# Altium schematic sheet TK525_Kraftforsyning.SchDoc: TK525 Kraftforsyning
size A3; Author: Øystein Smith; Organization: Omega Verksted; DocumentNumber: 16; Revision: 0; SheetNumber: 16; SheetTotal: 20
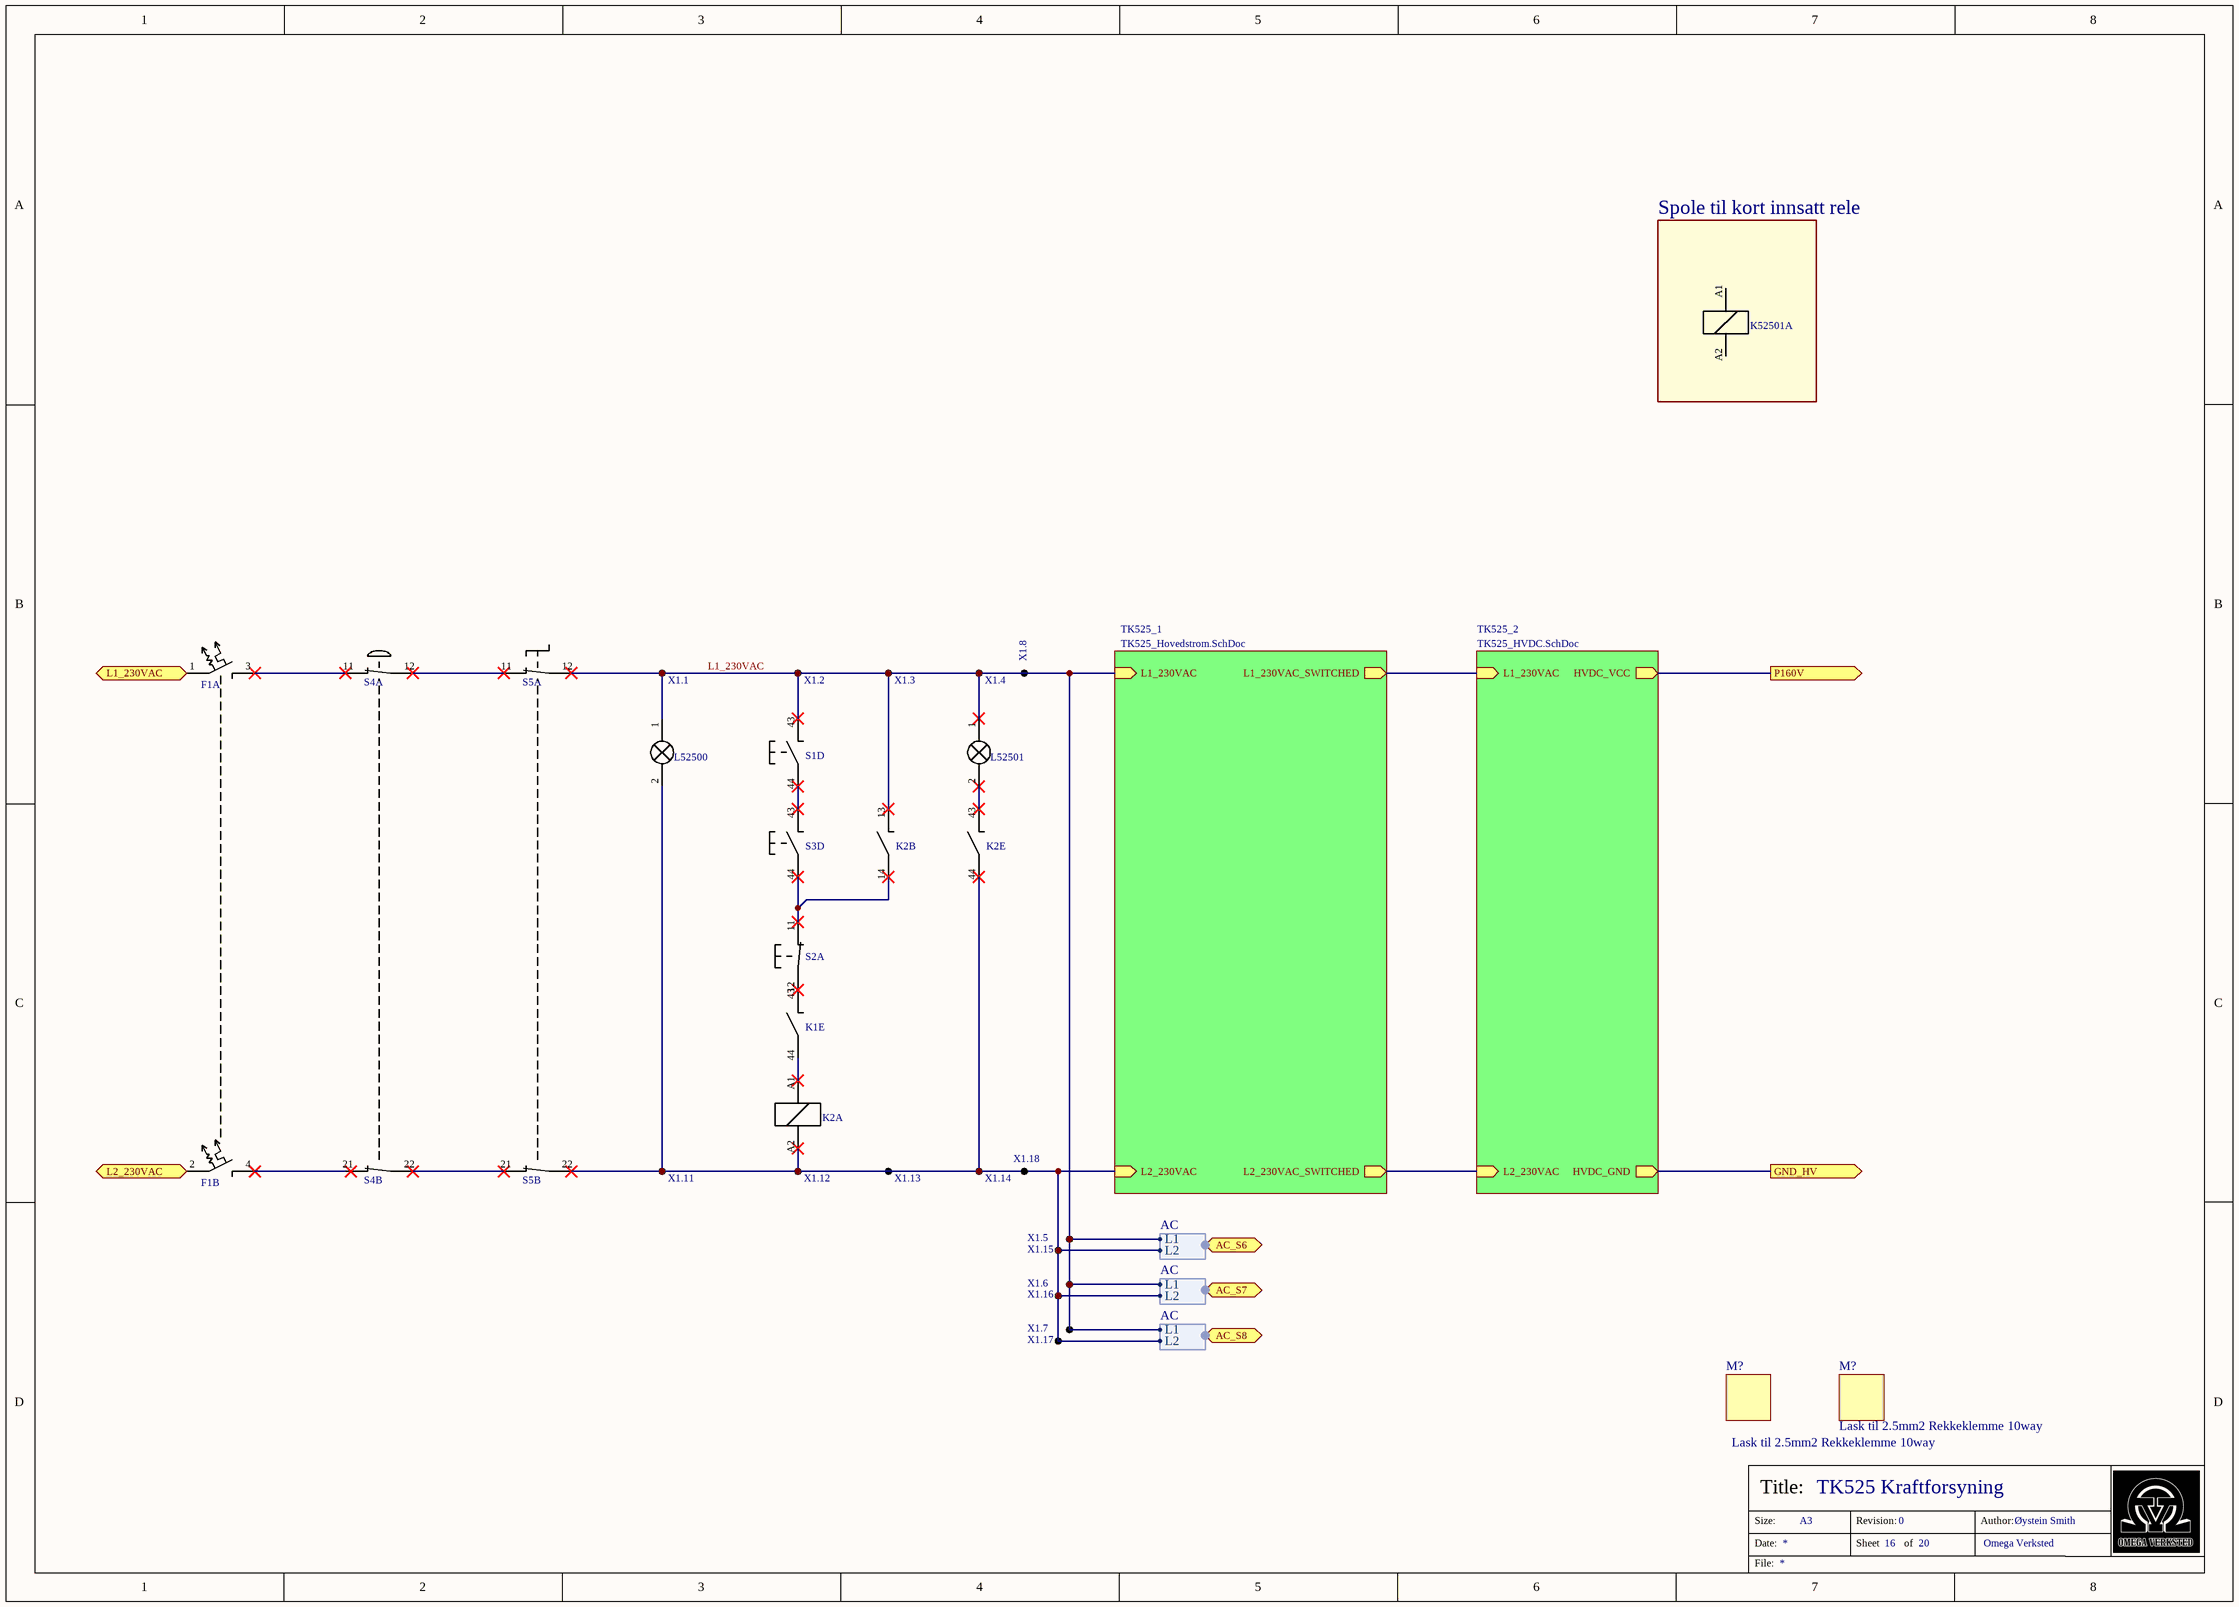
[diagram p0: TK525_Kraftforsyning.SchDoc]

## Parts
(Parts that share a designator on the sheet are numbered #1, #2 ... from top to bottom, then left to right.)
F1  Automatsikring  (value not drawn)  (parts A,B of 2)
K1  DIN-Rele 5V  (value not drawn)  (part E of 6)
K2  Kontaktor  (value not drawn)  (parts A,B,E of 6)
K52501  DIN-Rele 5V  (value not drawn)  (part A of 6)
L52500  Lampe  (value not drawn)
L52501  Lampe  (value not drawn)
M?#1  Lask til 2.5mm2 Rekkeklemme 10way
M?#2  Lask til 2.5mm2 Rekkeklemme 10way
S1  Automasjonsbryter  (value not drawn)  (parts D,G of 10)
S2  Automasjonsbryter  (value not drawn)  (parts A,G of 10)
S3  Automasjonsbryter  (value not drawn)  (parts D,G of 10)
S4  Automasjonsbryter  (value not drawn)  (parts A,B,I of 10)
S5  Automasjonsbryter  (value not drawn)  (parts A,B,J of 10)
X1.1  Rekkeklemme 2.5mm2  (value not drawn)
X1.2  Rekkeklemme 2.5mm2  (value not drawn)
X1.3  Rekkeklemme 2.5mm2  (value not drawn)
X1.4  Rekkeklemme 2.5mm2  (value not drawn)
X1.5  Rekkeklemme 2.5mm2  (value not drawn)
X1.6  Rekkeklemme 2.5mm2  (value not drawn)
X1.7  Rekkeklemme 2.5mm2  (value not drawn)
X1.8  Rekkeklemme 2.5mm2  (value not drawn)
X1.11  Rekkeklemme 2.5mm2  (value not drawn)
X1.12  Rekkeklemme 2.5mm2  (value not drawn)
X1.13  Rekkeklemme 2.5mm2  (value not drawn)
X1.14  Rekkeklemme 2.5mm2  (value not drawn)
X1.15  Rekkeklemme 2.5mm2  (value not drawn)
X1.16  Rekkeklemme 2.5mm2  (value not drawn)
X1.17  Rekkeklemme 2.5mm2  (value not drawn)
X1.18  Rekkeklemme 2.5mm2  (value not drawn)

## Blocks framed on the sheet
Spole til kort innsatt rele: K52501

## Sub-sheets
TK525_1 = TK525_Hovedstrom.SchDoc: L1_230VAC (in), L2_230VAC (in), L1_230VAC_SWITCHED (out), L2_230VAC_SWITCHED (out)
TK525_2 = TK525_HVDC.SchDoc: L2_230VAC (in), L1_230VAC (in), HVDC_GND (out), HVDC_VCC (out)

## Ports
AC_S6 (harness AC), AC_S7 (harness AC), AC_S8 (harness AC), GND_HV (out), L1_230VAC (in), L2_230VAC (in), P160V (out)

## Harnesses
AC: L1, L2

## Nets
GND_HV: port GND_HV, sheet TK525_2/HVDC_GND
L1_230VAC: K2.13 L52500.1 L52501.1 S1.43 S5.12 ; sheet TK525_1/L1_230VAC, port AC_S6.L1, port AC_S7.L1, port AC_S8.L1
L1_230VAC: F1.1 ; port L1_230VAC  [a separate net that carries the same name]
L2_230VAC: F1.2 ; port L2_230VAC
P160V: port P160V, sheet TK525_2/HVDC_VCC
NetF1_3: F1.3 S4.11
NetF1_4: F1.4 S4.21
NetK1_43: K1.43 S2.12
NetK1_44: K1.44 K2.A1
NetK2_14: K2.14 S2.11 S3.44
NetK2_43: K2.43 L52501.2
NetK2_44: K2.44 K2.A2 L52500.2 S5.22 ; sheet TK525_1/L2_230VAC, port AC_S6.L2, port AC_S7.L2, port AC_S8.L2
NetS1_44: S1.44 S3.43
NetS4_12: S4.12 S5.11
NetS4_22: S4.22 S5.21
(unnamed): sheet TK525_1/L1_230VAC_SWITCHED, sheet TK525_2/L1_230VAC
(unnamed): sheet TK525_1/L2_230VAC_SWITCHED, sheet TK525_2/L2_230VAC

Not connected (* = marked no-connect by the designer): K52501 A1 A2

## Notes on the sheet
- Size:
- Date:
- Title:
- A3
- Revision:
- Sheet
- of
- Author:
- File:

## Library data of the parts
F1 = 3183: 2-Pol; symbol_opprettet_av: 815; pris: 0; nokkelord: Sikring, Fuse; id: 3183; navn: Automatsikring; symbol_opprettet: 05.07.2015 13:21:53; pakketype: -
K1 K52501 = 4058: Coil: 5VDC, Contact: 250VAC 6A, DIN mount; symbol_opprettet_av: 815; pris: 310; id: 4058; leverandor_varenr: 1895933; produsent: ABB; leverandor: Farnell; navn: DIN-Rele 5V; symbol_opprettet: 7/4/2015 12:23:41 PM; pakketype: -
K2 = 3181: Industriellt rele; symbol_opprettet_av: 815; pris: 50; id: 3181; navn: Kontaktor; symbol_opprettet: 04.07.2015 12:23:41; nokkelord: Contactor; pakketype: -
L52500 L52501 = 3184: symbol_opprettet_av: 815; pris: 0; id: 3184; navn: Lampe; symbol_opprettet: 05.07.2015 14:08:53; nokkelord: Lamp; pakketype: -
M?#1 M?#2 = 4060: Jumper (Busbar), Cross Jumper, DIN Rail Screw Clamp Terminal Blocks, 10 Ways; id: 4060; symbol_opprettet_av: 815; leverandor_varenr: 2061384; pris: 17; produsent: Multicomp; leverandor: Farnell; symbol_opprettet: 3/12/2017 1:13:28 AM; navn: Lask til 2.5mm2 Rekkeklemme 10way; pakketype: -
S1-S5 = 3182: Kraftig; symbol_opprettet_av: 815; pris: 100; id: 3182; navn: Automasjonsbryter; symbol_opprettet: 05.07.2015 13:10:20; pakketype: -
X1.1-X1.8 X1.11-X1.18 = 4059: DIN Rail mount terminal block; id: 4059; symbol_opprettet_av: 815; leverandor_varenr: 2061376; pris: 5; nokkelord: CDU2.5; produsent: Multicomp; leverandor: Farnell; symbol_opprettet: 3/12/2017 12:15:42 AM; navn: Rekkeklemme 2.5mm2; pakketype: -